# EAGLE design a7105_fab (EAGLE 6.3)
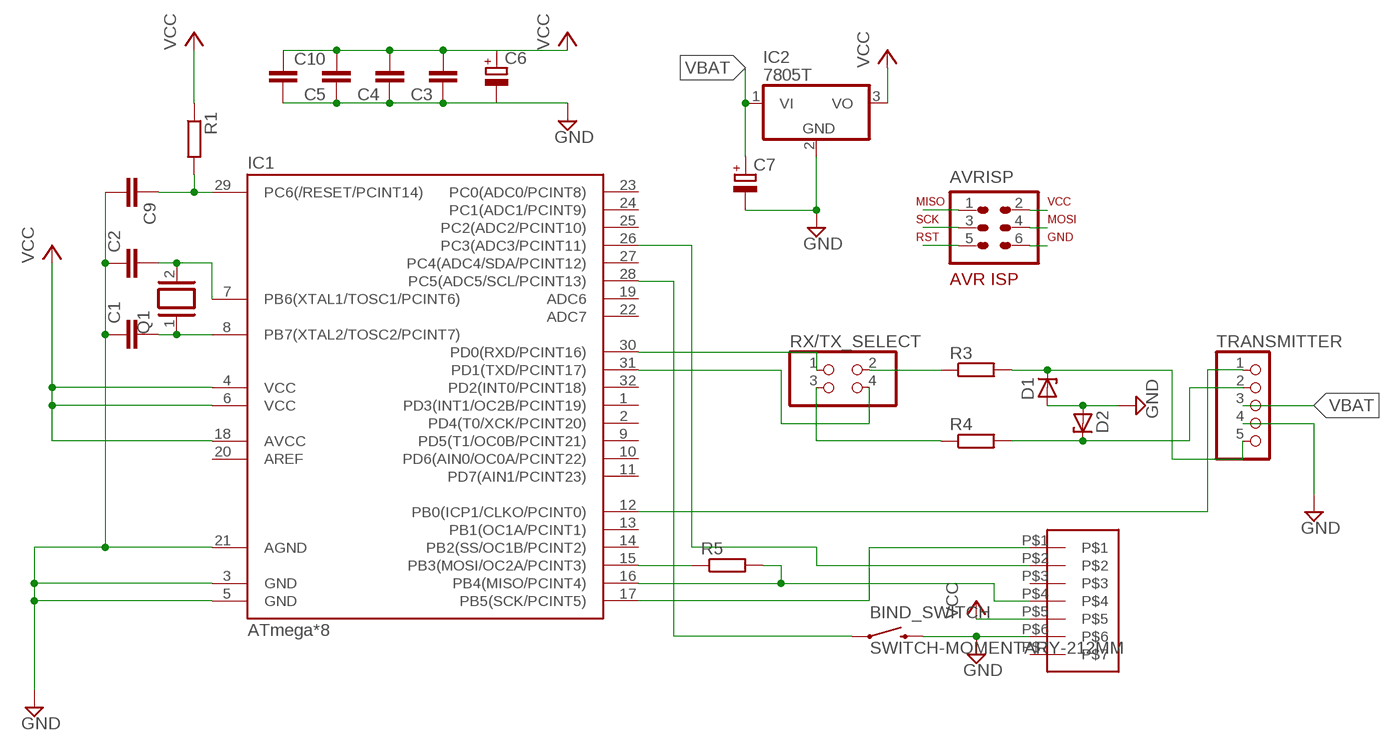
[diagram p0: schematic, sheet 1]

## Parts
AVRISP  AVR-ISP-6VERT  [AVR-ISP-6]
BIND_SWITCH  SWITCH-MOMENTARY-212MM  [TACTILE-PTH-12MM]
C1  C-EUC0805  [C0805]
C2  C-EUC0805  [C0805]
C3  C-EUC0805  [C0805]
C4  C-EUC0805  [C0805]
C5  C-EUC0805  [C0805]
C6  CPOL-EUE2.5-6  [E2,5-6]
C7  CPOL-EUE2.5-6  [E2,5-6]
C9  C-EUC0805  [C0805]
C10  C-EUC0805  [C0805]
D1  ZENER-DIODESOD80C  [SOD80C]
D2  ZENER-DIODESOD80C  [SOD80C]
IC1  ATmega*8  MEGA48/88/168-AU  [TQFP32-08]
IC2  7805T  [TO220H]
Q1  XTAL/S  [QS]
R1  R-EU_M0805  [M0805]
R3  R-EU_M0805  [M0805]
R4  R-EU_M0805  [M0805]
R5  R-EU_M0805  [M0805]
RX/TX_SELECT  PINHD-2X2  [2X02]
TRANSMITTER  PINHD-1X5  [1X05]
U$1  PIN-HEAD7-1.8  [PIN-HEAD7-1.8]

## Nets
AVR_RXD: IC1.30(PD0(RXD/PCINT16)) RX/TX_SELECT.1
AVR_TXD: IC1.31(PD1(TXD/PCINT17)) RX/TX_SELECT.4
CE: IC1.26(PC3(ADC3/PCINT11)) U$1.P$2
GND: AVRISP.6 BIND_SWITCH.3 C1.1 C2.1 C3.1 C4.1 C5.1 C6.- C7.- C9.2 C10.2 D1.A D2.A IC1.3(GND) IC1.5(GND) IC1.21(AGND) TRANSMITTER.4 U$1.P$6
MISO: AVRISP.1 IC1.16(PB4(MISO/PCINT4)) R5.2 U$1.P$4
MOSI: AVRISP.4 IC1.15(PB3(MOSI/OC2A/PCINT3)) R5.1
N$1: D2.C R4.2 TRANSMITTER.2
N$3: R4.1 RX/TX_SELECT.3
N$4: R3.1 RX/TX_SELECT.2
N$5: D1.C R3.2 TRANSMITTER.5
N$6: C1.2 IC1.8(PB7(XTAL2/TOSC2/PCINT7)) Q1.1
N$7: C2.2 IC1.7(PB6(XTAL1/TOSC1/PCINT6)) Q1.2
N$8: BIND_SWITCH.1 IC1.28(PC5(ADC5/SCL/PCINT13))
PPM: IC1.12(PB0(ICP1/CLKO/PCINT0)) TRANSMITTER.1
RST: AVRISP.5 C9.1 IC1.29(PC6(/RESET/PCINT14)) R1.2
SCK: AVRISP.3 IC1.17(PB5(SCK/PCINT5)) U$1.P$1
VBAT: C7.+ IC2.1(VI) TRANSMITTER.3
VCC: AVRISP.2 C3.2 C4.2 C5.2 C6.+ C10.1 IC1.4(VCC) IC1.6(VCC) IC1.18(AVCC) IC2.3(VO) R1.1 U$1.P$5
Unconnected: IC1.1(PD3(INT1/OC2B/PCINT19)) IC1.2(PD4(T0/XCK/PCINT20)) IC1.9(PD5(T1/OC0B/PCINT21)) IC1.10(PD6(AIN0/OC0A/PCINT22)) IC1.11(PD7(AIN1/PCINT23)) IC1.13(PB1(OC1A/PCINT1)) IC1.14(PB2(SS/OC1B/PCINT2)) IC1.19(ADC6) IC1.20(AREF) IC1.22(ADC7) IC1.23(PC0(ADC0/PCINT8)) IC1.24(PC1(ADC1/PCINT9)) IC1.25(PC2(ADC2/PCINT10)) IC1.27(PC4(ADC4/SDA/PCINT12)) IC1.32(PD2(INT0/PCINT18)) IC2.2(GND) U$1.P$3 U$1.P$7

## Library data of the parts
AVRISP = avr-7:AVR-ISP-6: AVR ISP-6 Serial Programming Header
BIND_SWITCH = SparkFun-Electromechanical:SWITCH-MOMENTARY-2: Various NO switches- pushbuttons, reed, etc
C1-C5 C9 C10 = rcl:C-EU: CAPACITOR, European symbol
C6 C7 = rcl:CPOL-EU: POLARIZED CAPACITOR, European symbol
D1 D2 = diode:ZENER-DIODE: Z-Diode
IC1 = avr-7:MEGA48/88/168
IC2 = linear:78*: Positive VOLTAGE REGULATOR Source: http://cache.national.com/ds/LM/LM78L05.pdf http://www.fairchildsemi.com/ds/LM/LM7805.pdf
Q1 = special:XTAL/S: CRYSTAL
R1 R3-R5 = rcl:R-EU_: RESISTOR, European symbol
RX/TX_SELECT = pinhead:PINHD-2X2: PIN HEADER
TRANSMITTER = pinhead:PINHD-1X5: PIN HEADER
U$1 = untitled:PIN-HEAD7-1.8

## Board
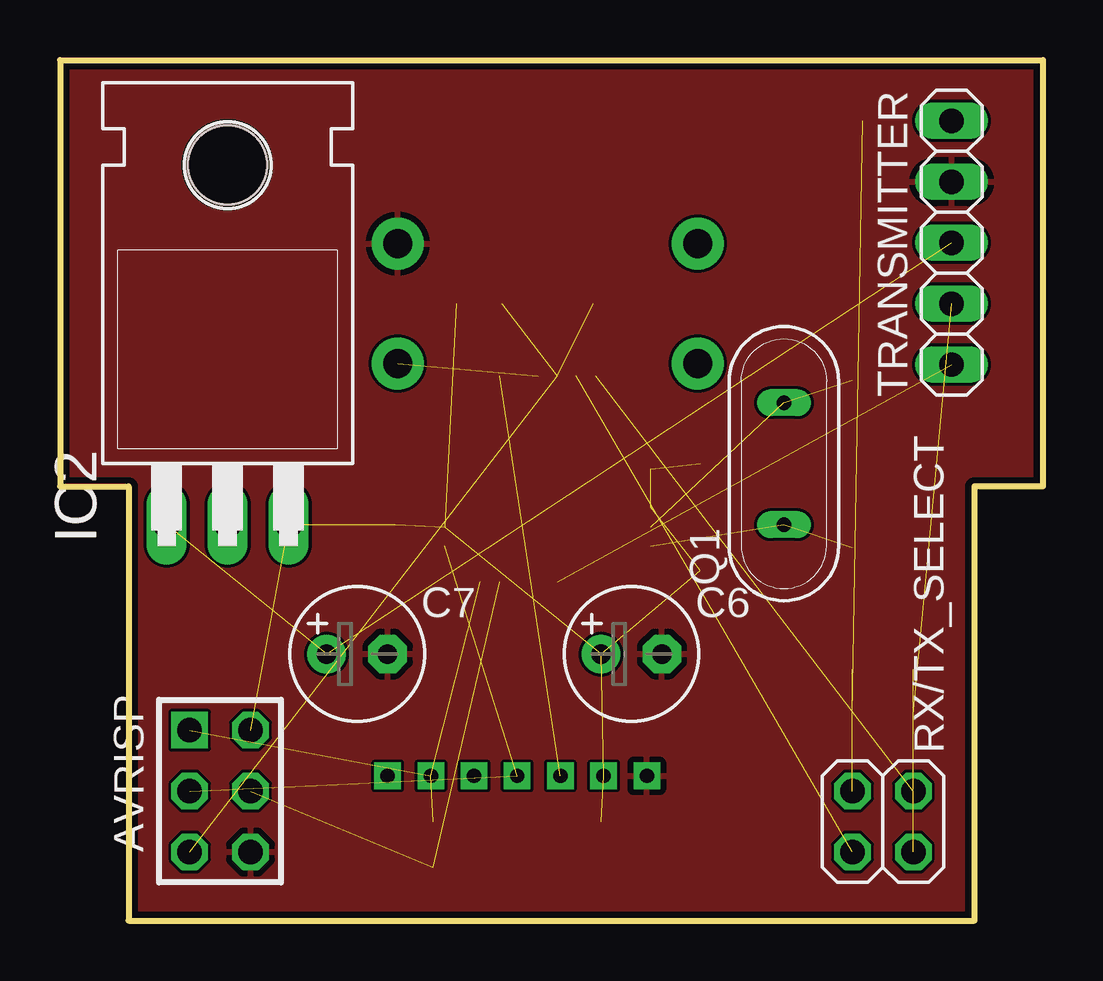
[diagram p1: board, top side]
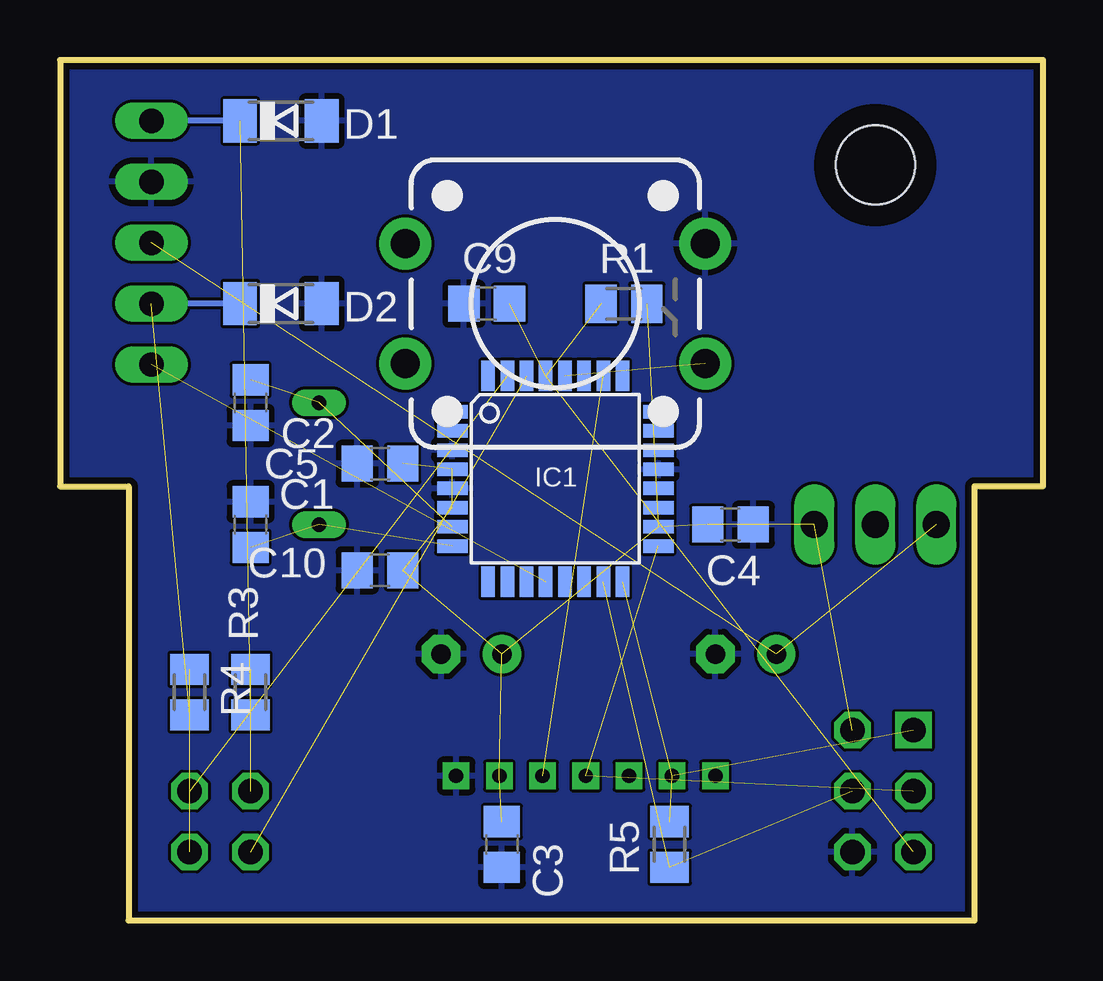
[diagram p2: board, bottom side, seen from below]

Size 40.96 x 35.88 mm. Coordinates in mm from the lower left corner, seen from the top.
Outline: 0,35.87 0,18.1
Outline: 0,18.1 0,35.88 40.96,35.88 40.96,18.1 38.1,18.1 38.1,0 2.86,0 2.86,18.1 0,18.1
Copper layers (1*16): Top 0.035mm / dielectric 1.5mm / Bottom 0.035mm
Design rules "dirt_cheap_dirty_boards.v1": minimum track width 5mil, minimum drill 12mil, track to track 5mil, track to pad 5mil, pad to pad 5mil, via to via 5mil, smd to smd 0mil, copper to edge 10mil, drill to drill 10mil, minimum pad ring 10mil, minimum via ring 6mil, stop-mask expansion 2mil, vias tented up to drill 25mil, thermal gap 10mil

### Footprints (pad centres in the part's own frame; a part is rotated, then mirrored left to right if it is on the bottom)
AVR-ISP-6 = drill 1.016 square: 1 -2.54,-1.27 | drill 1.016 octagon: 2 -2.54,1.27; 3 0,-1.27; 4 0,1.27; 5 2.54,-1.27; 6 2.54,1.27
TACTILE-PTH-12MM = drill 1.2 pad 2.159: 1 6.25,-2.5; 2 -6.25,-2.5; 3 6.25,2.5; 4 -6.25,2.5
C0805 = smd 1.3 x 1.5: 1 -0.95,0; 2 0.95,0
E2,5-6 = drill 0.813 pad 1.6: + -1.27,0 | drill 0.813 pad 1.6 octagon: - 1.27,0
SOD80C = smd 1.4 x 1.8: A 1.7,0; C -1.7,0
TQFP32-08 = smd 1.27 x 0.559: 1 -4.293,2.8; 2 -4.293,2; 3 -4.293,1.2; 4 -4.293,0.4; 5 -4.293,-0.4; 6 -4.293,-1.2; 7 -4.293,-2; 8 -4.293,-2.8; 17 4.293,-2.8; 18 4.293,-2; 19 4.293,-1.2; 20 4.293,-0.4; 21 4.293,0.4; 22 4.293,1.2; 23 4.293,2; 24 4.293,2.8 | smd 0.559 x 1.27: 9 -2.8,-4.293; 10 -2,-4.293; 11 -1.2,-4.293; 12 -0.4,-4.293; 13 0.4,-4.293; 14 1.2,-4.293; 15 2,-4.293; 16 2.8,-4.293; 25 2.8,4.293; 26 2,4.293; 27 1.2,4.293; 28 0.4,4.293; 29 -0.4,4.293; 30 -1.2,4.293; 31 -2,4.293; 32 -2.8,4.293
TO220H = drill 1.118 long: 1 -2.54,-10.16; 2 0,-10.16; 3 2.54,-10.16 | hole 3.302: 0,4.826
QS = drill 0.61 long: 1 -2.54,0; 2 2.54,0
M0805 = smd 1.3 x 1.6: 1 -0.95,0; 2 0.95,0
2X02 = drill 1.016 octagon: 1 -1.27,-1.27; 2 -1.27,1.27; 3 1.27,-1.27; 4 1.27,1.27
1X05 = drill 1.016 long: 1 -5.08,0; 2 -2.54,0; 3 0,0; 4 2.54,0; 5 5.08,0
PIN-HEAD7-1.8 = drill 0.6 square: P$1 0,0; P$2 -1.8,0; P$3 1.8,0; P$4 3.6,0; P$5 -3.6,0; P$6 -5.4,0; P$7 5.4,0

### Placement (x,y rotation side)
AVRISP  6.67,5.4 270 top
BIND_SWITCH  20.32,25.72 0 bottom
C1  33.02,16.51 270 bottom
C2  33.02,21.59 90 bottom
C3  22.54,3.17 90 bottom
C4  13.02,16.51 180 bottom
C5  27.62,19.05 0 bottom
C6  23.81,11.11 0 top
C7  12.38,11.11 0 top
C9  23.18,25.72 180 bottom
C10  27.62,14.61 180 bottom
D1  31.75,33.34 0 bottom
D2  31.75,25.72 0 bottom
IC1  20.32,18.41 0 bottom
IC2  6.99,26.67 0 top
Q1  30.16,19.05 90 top
R1  17.46,25.72 180 bottom
R3  33.02,9.53 270 bottom
R4  35.56,9.53 270 bottom
R5  15.56,3.17 90 bottom
RX/TX_SELECT  34.29,4.13 0 top
TRANSMITTER  37.15,28.26 90 top
U$1  19.05,6.03 0 bottom

### Tracks (layer width: path | path; a pad name or v marks a point on that pad's centre or on a via)
AVR_RXD  (1 unrouted)
AVR_TXD  (1 unrouted)
CE  (1 unrouted)
GND
  pour Bottom: -0.95,36.83 -0.95,17.14 1.91,17.14 1.91,-0.64 39.05,-0.64 39.05,17.14 41.91,17.14 41.91,36.83
  pour Top: -0.95,36.83 -0.95,17.14 1.91,17.14 1.91,-0.64 39.05,-0.64 39.05,17.14 41.91,17.14 41.91,36.83
MISO  (3 unrouted)
MOSI  (2 unrouted)
N$1  (1 unrouted)
  Bottom 0.254: D2.C TRANSMITTER.2
N$3  (1 unrouted)
N$4  (1 unrouted)
N$5  (1 unrouted)
  Bottom 0.254: D1.C TRANSMITTER.5
N$6  (2 unrouted)
N$7  (2 unrouted)
N$8  (1 unrouted)
PPM  (1 unrouted)
RST  (3 unrouted)
SCK  (2 unrouted)
VBAT  (2 unrouted)
VCC  (11 unrouted)